# EAGLE design dynext_v2.1 (EAGLE 6.4)
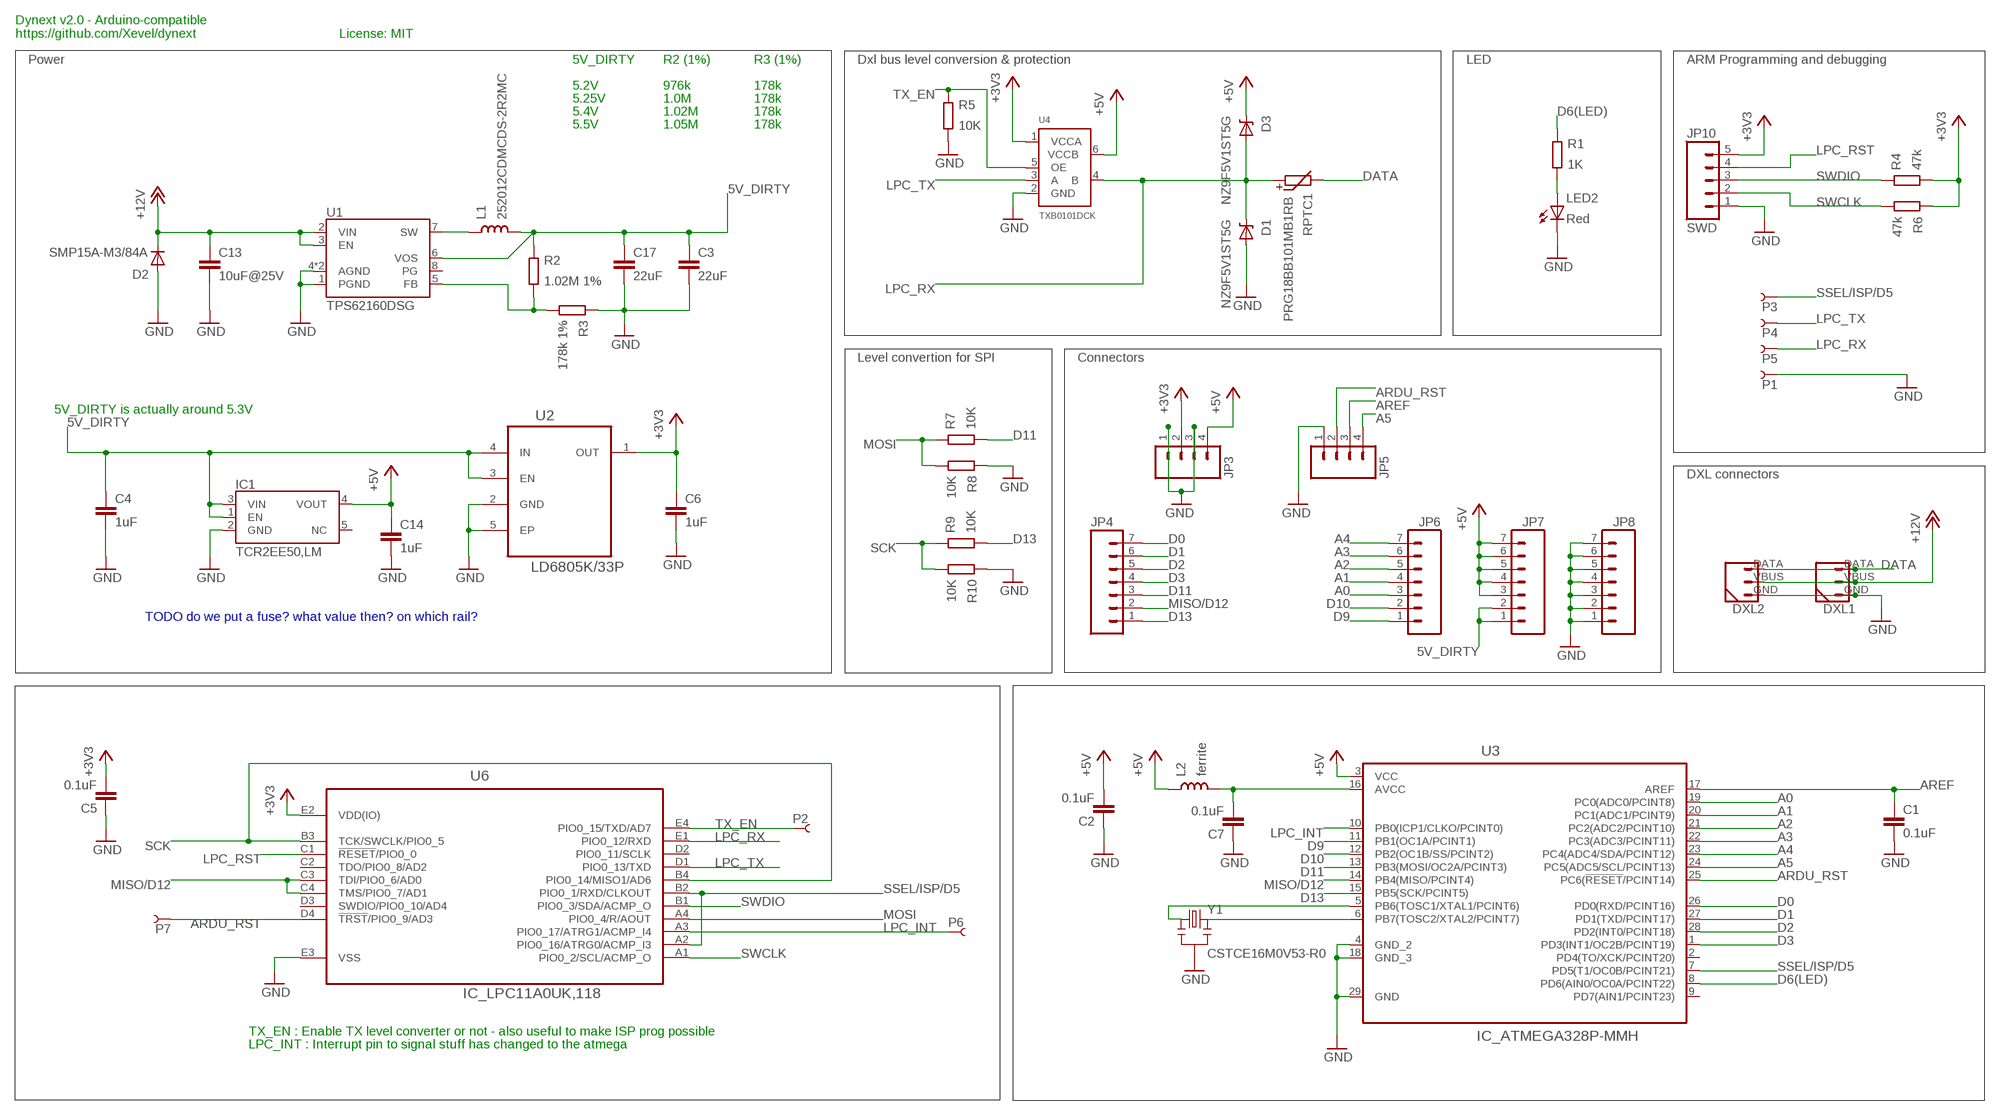
[diagram p0: schematic, sheet 1]

## Parts
C1  0.1uF  C0201  [0201_N]
C2  0.1uF  C0201  [0201_N]
C3  22uF  C1206  [1206_N]
C4  1uF  C0402  [0402_N]
C5  0.1uF  C0201  [0201_N]
C6  1uF  C0402  [0402_N]
C7  0.1uF  C0201  [0201_N]
C13  10uF@25V  C0805  [0805_N]
C14  1uF  C0402  [0402_N]
C17  22uF  C1206  [1206_N]
D1  NZ9F5V1ST5G  DIODE_ZENER-923  [SOD-923_N]
D2  SMP15A-M3/84A  DIODE-SMP  [DO-220AA]
D3  NZ9F5V1ST5G  DIODE_ZENER-923  [SOD-923_N]
DXL1  DYNAMIXEL_3POS-R  [DYNAMIXEL_3POS_RIGHT]
DXL2  DYNAMIXEL_3POS-R  [DYNAMIXEL_3POS_RIGHT]
IC1  TCR2EE50,LM  IC_TCR2EEESV  [SOT50P160X60-5N]
JP3  M041X04_NO_SILK  [1X04_NO_SILK]
JP4  M07NO_SILK  [1X07_NO_SILK]
JP5  M041X04_NO_SILK  [1X04_NO_SILK]
JP6  M07NO_SILK  [1X07_NO_SILK]
JP7  M07NO_SILK  [1X07_NO_SILK]
JP8  M07SQUARE_ALL  [1X07_SQUARE_ALL]
JP10  SWD  M051.27MM  [1X05-1.27MM]
L1  252012CDMCDS-2R2MC  L1008  [1008_N]
L2  ferrite  L0402  [0402_N]
LED2  Red  LED0603  [D_0603_N]
P1  PIN_SMD_0.8X2  [PIN_SMD_0.8X2]
P2  PIN_SMD_1X1  [PIN_SMD_1X1]
P3  PIN_SMD_0.8X2  [PIN_SMD_0.8X2]
P4  PIN_SMD_0.8X2  [PIN_SMD_0.8X2]
P5  PIN_SMD_0.8X2  [PIN_SMD_0.8X2]
P6  PIN_SMD_1X1  [PIN_SMD_1X1]
P7  PIN_SMD_1X1  [PIN_SMD_1X1]
R1  1K  R0201  [0201_N]
R2  1.02M 1%  R0201  [0201_N]
R3  178k 1%  R0201  [0201_N]
R4  47k  R0201  [0201_N]
R5  10K  R0201  [0201_N]
R6  47k  R0201  [0201_N]
R7  10K  R0201  [0201_N]
R8  10K  R0201  [0201_N]
R9  10K  R0201  [0201_N]
R10  10K  R0201  [0201_N]
RPTC1  PRG18BB101MB1RB  R-PTC0603  [0603_N]
U1  TPS62160DSG  IC_TPS62160DSG_L  [SON50P200X200X80-9L]
U2  LD6805K/33P  [NXP_LD6805]
U3  IC_ATMEGA328P-MMH  [QFN45P400X400X100-29N]
U4  TXB0101DCK  [SC70-6]
U6  IC_LPC11A0UK,118  [BGA20C50P_250X250X65]
Y1  CSTCE16M0V53-R0  RESONATOR16MHZ  [RESONATOR-SMD]

## Nets
5V_DIRTY: C3.1 C4.1 C17.1 IC1.1(EN) IC1.3(VIN) JP7.1 JP7.2 L1.2 R2.2 U1.6(VOS) U2.3(EN) U2.4(IN)
+3V3: C5.2 C6.1 JP3.2 JP10.5 R4.1 R6.2 U2.1(OUT) U4.1(VCCA) U6.E2(VDD(IO))
+5V: C2.2 C14.1 D3.C IC1.4(VOUT) JP3.4 JP7.3 JP7.4 JP7.5 JP7.6 JP7.7 L2.1 U3.3(VCC) U4.6(VCCB)
+12V: C13.1 D2.C DXL1.VBUS DXL2.VBUS U1.2(VIN) U1.3(EN)
A0: JP6.3 U3.19(PC0(ADC0/PCINT8))
A1: JP6.4 U3.20(PC1(ADC1/PCINT9))
A2: JP6.5 U3.21(PC2(ADC2/PCINT10))
A3: JP6.6 U3.22(PC3(ADC3/PCINT11))
A4: JP6.7 U3.23(PC4(ADC4/SDA/PCINT12))
A5: JP5.4 U3.24(PC5(ADC5/SCL/PCINT13))
ARDU_RST: JP5.2 P7.P$1 U3.25(PC6(!RESET!/PCINT14)) U6.D4(!TRST!/PIO0_9/AD3)
AREF: C1.1 JP5.3 U3.17(AREF)
AVCC: C7.2 L2.2 U3.16(AVCC)
D0: JP4.7 U3.26(PD0(RXD/PCINT16))
D1: JP4.6 U3.27(PD1(TXD/PCINT17))
D2: JP4.5 U3.28(PD2(INT0/PCINT18))
D3: JP4.4 U3.1(PD3(INT1/OC2B/PCINT19))
D6(LED): R1.2 U3.8(PD6(AIN0/OC0A/PCINT22))
D9: JP6.1 U3.11(PB1(OC1A/PCINT1))
D10: JP6.2 U3.12(PB2(OC1B/SS/PCINT2))
D11: JP4.3 R7.1 U3.13(PB3(MOSI/OC2A/PCINT3))
D13: JP4.1 R9.1 U3.15(PB5(SCK/PCINT5))
DATA: DXL1.DATA DXL2.DATA RPTC1.2
GND: C1.2 C2.1 C3.2 C4.2 C5.1 C6.2 C7.1 C13.2 C14.2 C17.2 D1.A D2.A DXL1.GND DXL2.GND IC1.2(GND) JP3.1 JP3.3 JP5.1 JP8.1 JP8.2 JP8.3 JP8.4 JP8.5 JP8.6 JP8.7 JP10.1 LED2.C P1.PIN R3.2 R5.1 R8.2 R10.2 U1.1(PGND) U1.4(AGND) U1.9(AGND) U2.2(GND) U2.5(EP) U3.4(GND_2) U3.18(GND_3) U3.29(GND) U4.2(GND) U6.E3(VSS) Y1.2
LPC_INT: P6.P$1 U3.10(PB0(ICP1/CLKO/PCINT0)) U6.A3(PIO0_17/ATRG1/ACMP_I4)
LPC_RST: JP10.4 U6.C1(!RESET!/PIO0_0)
LPC_RX: D1.C D3.A P5.PIN RPTC1.1 U4.4(B) U6.E1(PIO0_12/RXD)
LPC_TX: P4.PIN U4.3(A) U6.D1(PIO0_13/TXD)
MISO/D12: JP4.2 U3.14(PB4(MISO/PCINT4)) U6.C3(TDI/PIO0_6/AD0) U6.C4(TMS/PIO0_7/AD1)
MOSI: R7.2 R8.1 U6.A4(PIO0_4/R/AOUT)
N$2: L1.1 U1.7(SW)
N$3: LED2.A R1.1
N$9: U3.5(PB6(TOSC1/XTAL1/PCINT6)) Y1.1
N$10: U3.6(PB7(TOSC2/XTAL2/PCINT7)) Y1.3
N$12: R2.1 R3.1 U1.5(FB)
SCK: R9.2 R10.1 U6.B3(TCK/SWCLK/PIO0_5) U6.B4(PIO0_14/MISO1/AD6)
SSEL/ISP/D5: P3.PIN U3.7(PD5(T1/OC0B/PCINT21)) U6.A2(PIO0_16/ATRG0/ACMP_I3) U6.B2(PIO0_1/RXD/CLKOUT)
SWCLK: JP10.2 R6.1 U6.A1(PIO0_2/SCL/ACMP_O)
SWDIO: JP10.3 R4.2 U6.B1(PIO0_3/SDA/ACMP_O)
TX_EN: P2.P$1 R5.2 U4.5(OE) U6.E4(PIO0_15/TXD/AD7)
Unconnected: IC1.5(NC) U1.8(PG) U3.2(PD4(TO/XCK/PCINT20)) U3.9(PD7(AIN1/PCINT23)) U6.C2(TDO/PIO0_8/AD2) U6.D2(PIO0_11/SCLK) U6.D3(SWDIO/PIO0_10/AD4)

## Notes on the sheet
- Dynext v2.0 - Arduino-compatible
  https://github.com/Xevel/dynext
- License: MIT
- Power | 5V_DIRTY | R2 (1%) | R3 (1%) | Dxl bus level conversion & protection | LED | ARM Programming and debugging
- 5.2V | 976k | 178k
- 5.25V | 1.0M | 178k
- 5.4V | 1.02M | 178k
- 5.5V | 1.05M | 178k
- Level convertion for SPI | Connectors
- 5V_DIRTY is actually around 5.3V
- DXL connectors
- TODO do we put a fuse? what value then? on which rail?
- TX_EN : Enable TX level converter or not - also useful to make ISP prog possible
- LPC_INT : Interrupt pin to signal stuff has changed to the atmega

## Library data of the parts
C1-C7 C13 C14 C17 = Xevelabs:C: Non-polarized Capacitor
D1 D3 = Xevelabs:DIODE_ZENER: Zener Diode
D2 = Xevelabs:DIODE: Diode
DXL1 DXL2 = Xevelabs:DYNAMIXEL_3POS
IC1 = Xevelabs:IC_TCR2EE
JP3 JP5 = SparkFun-Connectors:M04: Header 4 Standard 4-pin 0.1" header. Use with straight break away headers (SKU : PRT-00116), right angle break away headers (PRT-00553), swiss pins (PRT-00743), machine pins (PRT-00117), and female headers (PRT-00115). Molex polarized connector foot print use with SKU : PRT-08231 with associated crimp pins and housings. 1MM SMD Version SKU: PRT-10208
JP4 JP6-JP8 = Xevelabs:M07: Header 7 Standard 7-pin 0.1" header. Use with straight break away headers (SKU : PRT-00116), right angle break away headers (PRT-00553), swiss pins (PRT-00743), machine pins (PRT-00117), and female headers (PRT-00115). NOTES ON THE VARIANTS LOCK and LOCK_LONGPADS... This footprint was designed to help hold the alignment of a through-hole component (i.e. 7-pin header) while soldering it into place. You may notice that each hole has been shifted either up or down by 0.005 of an inch from it's more standard position (which is usually a perfectly straight line). This slight alteration caused the pins (the squares in the middle) to touch the edges of the holes. Because they are alternating, it causes a "brace" to hold the header in place. 0.005 has proven to be the perfect amount of "off-center" position when using our standard breakaway headers. Although looks a little odd when you look at the bare footprint, once you have a header in there, the alteration is very hard to notice. Also, if you push a header all the way into place, it is covered up entirely on the bottom side. This idea of altering the position of holes to aid alignment will be further integrated into the Sparkfun Library for other footprints. It can help hold any component with 3 or more connection pins.
JP10 = SparkFun-Connectors:M05: Header 5 Standard 5-pin 0.1" header. Use with straight break away headers (SKU : PRT-00116), right angle break away headers (PRT-00553), swiss pins (PRT-00743), machine pins (PRT-00117), and female headers (PRT-00115). Molex polarized connector foot print use with SKU : PRT-08230 with associated crimp pins and housings.
L1 L2 = Xevelabs:L
LED2 = Xevelabs:LED: LED
P1-P7 = Xevelabs:PIN
R1-R10 = Xevelabs:R: Resistor
RPTC1 = Xevelabs:R-PTC: PTC (Positive Temperature Coefficient) Resistor
U1 = Xevelabs:IC_TPS62160
U2 = NXP-LD6805K:LD6805K/: Low-dropout regulators, high PSRR, 150 mA, DFN1010C-4; MPN: LD6805K/33P; OC_FARNELL: 2095530; OC_NEWARK: 93T1648; PACKAGE: DFN1010C-4; SUPPLIER: NXP
U3 = Xevelabs:IC_ATMEGA328P-MMH: MCU, 8BIT, AVR, MODL,QFN-28; MPN: ATMEGA328P-MMH; OC_FARNELL: 2066295; OC_NEWARK: 68T2937; PACKAGE: QFN-28; SUPPLIER: ATMEL
U4 = Xevelabs:TXB0101
U6 = Xevelabs:IC_LPC11A0?UK,118: IC, MCU, 32BIT, CORTEX M0, 20WLCSP LPC11A02UK,118 LPC11A04UK,118; MPN: LPC11A02UK,118; OC_FARNELL: 2218102; OC_NEWARK: 46W4731; PACKAGE: WLCSP20; SUPPLIER: NXP
Y1 = SparkFun-FreqCtrl:RESONATOR: Resonator Small SMD resonator. Used, eg, on the Arduino Pro/ Pro Mini boards. 8MHz- XTAL-08895 16MHz- XTAL-08900; PROD_ID: XTAL-08900; VALUE: 16MHz

## Board
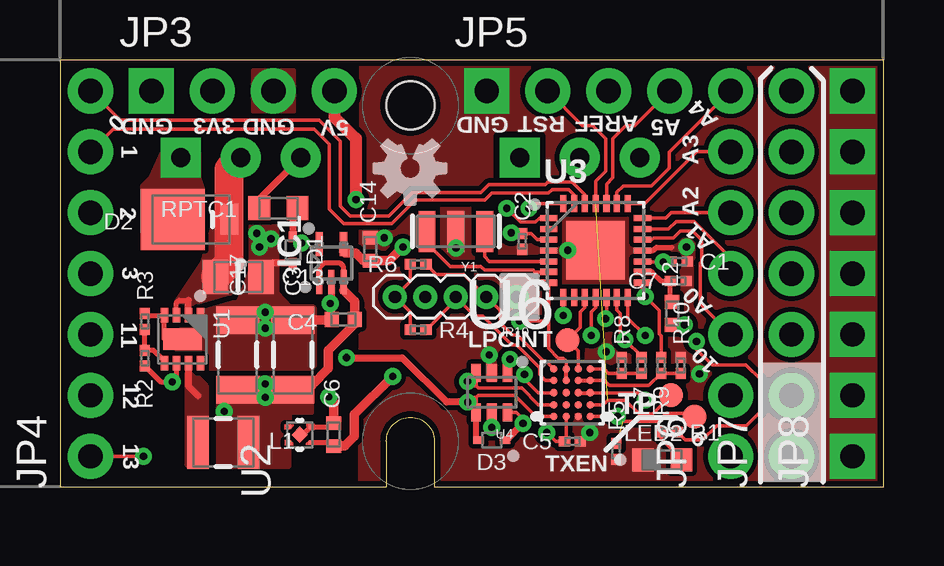
[diagram p1: board, top side]
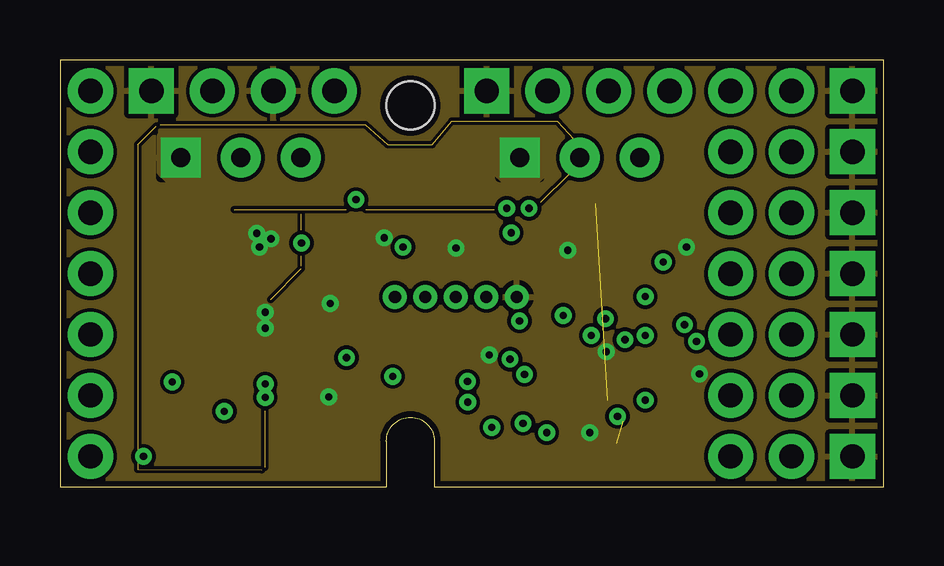
[diagram p2: board, inner layer GND]
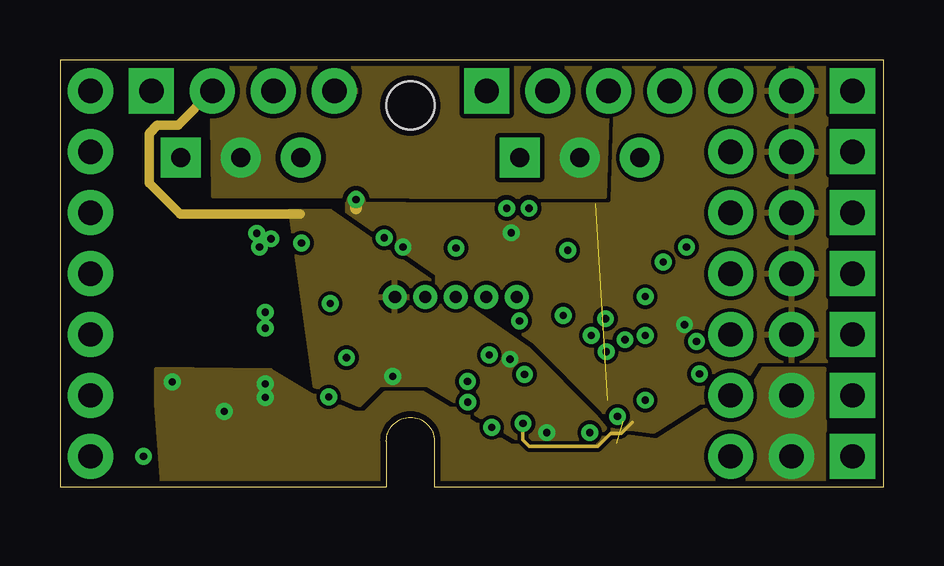
[diagram p3: board, inner layer POWER]
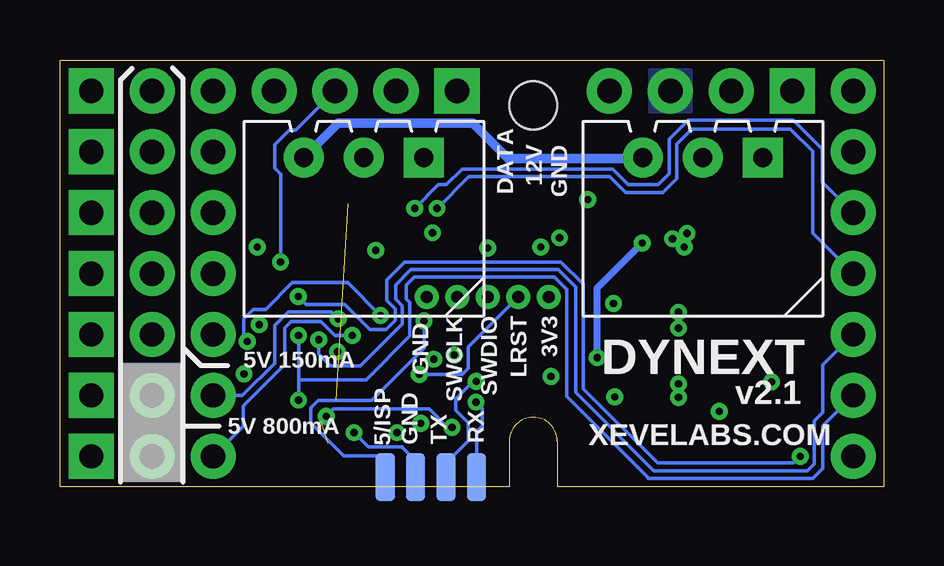
[diagram p4: board, bottom side, seen from below]

Size 34.32 x 17.8 mm. Coordinates in mm from the lower left corner, seen from the top.
Outline: 34.32,0 34.32,17.8 0,17.8 0,0 13.6,0 13.6,1.9 arc-180 15.6,1.9 15.6,0 34.32,0
Copper layers (1*2*3*16): Top 0.035mm / dielectric 0.15mm / GND 0.035mm / dielectric 1.1mm / POWER 0.035mm / dielectric 0.15mm / Bottom 0.035mm
Design rules "Xevelabs_6mil_4layers_eurocircuits *": minimum track width 0.15mm, minimum drill 0.25mm, track to track 0.155mm, track to pad 0.155mm, pad to pad 0.155mm, via to via 0.155mm, smd to smd 0mil, copper to edge 0.25mm, drill to drill 0.25mm, minimum pad ring 0.15mm, minimum via ring 0.2mm, stop-mask expansion 0mil, vias tented up to drill 100mil, thermal gap 0.2mm
Holes 2 mm at 14.6,15.9
tRestrict: area 18.3,12.9 to 20,14.6

### Footprints (pad centres in the part's own frame; a part is rotated, then mirrored left to right if it is on the bottom)
0201_N = smd 0.46 x 0.42: 1 -0.33,0; 2 0.33,0
1206_N = smd 1.15 x 1.8: 1 -1.45,0; 2 1.45,0
0402_N = smd 0.57 x 0.62: 1 -0.48,0; 2 0.48,0
0805_N = smd 1.05 x 1.4: 1 -0.95,0; 2 0.95,0
SOD-923_N = smd 0.43 x 0.32: A 0.55,0; C -0.55,0
DO-220AA = smd 2.67 x 2.54: A 0.7,0 | smd 0.76 x 1.27: C -1.65,0
DYNAMIXEL_3POS_RIGHT = drill 0.8 pad 1.676: DATA 0,-5; VBUS 0,-2.5 | drill 0.8 pad 1.676 square: GND 0,0
SOT50P160X60-5N = smd 0.991 x 0.254: 1 -0.787,0.508; 2 -0.787,0; 3 -0.787,-0.508 | smd 0.991 x 0.305: 4 0.787,-0.508; 5 0.787,0.508
1X04_NO_SILK = drill 1.016 pad 1.88 square: 1 0,0 | drill 1.016 pad 1.88: 2 2.54,0; 3 5.08,0; 4 7.62,0
1X07_NO_SILK = drill 1.016 pad 1.88: 1 0,0; 2 2.54,0; 3 5.08,0; 4 7.62,0; 5 10.16,0; 6 12.7,0; 7 15.24,0
1X07_SQUARE_ALL = drill 1.016 pad 1.88 square: 1 0,0; 2 2.54,0; 3 5.08,0; 4 7.62,0; 5 10.16,0; 6 12.7,0; 7 15.24,0
1X05-1.27MM = drill 0.508 pad 1: 1 0,0; 2 1.27,0; 3 2.54,0; 4 3.81,0; 5 5.08,0
1008_N = smd 0.9 x 2.2: 1 -1.05,0; 2 1.05,0
D_0603_N = smd 0.9 x 0.95: A 0.8,0; C -0.8,0
PIN_SMD_0.8X2 = smd 2 x 0.8: PIN 0,0
PIN_SMD_1X1 = smd 1 x 1: P$1 0,0
0603_N = smd 0.9 x 1: 1 -0.8,0; 2 0.8,0
SON50P200X200X80-9L = smd 0.6 x 0.3: 1 -1,0.75; 2 -1,0.25; 3 -1,-0.25; 4 -1,-0.75; 5 1,-0.75; 6 1,-0.25; 7 1,0.25; 8 1,0.75 | smd 0.9 x 1.6: 9 0,0
NXP_LD6805 = smd 0.17 x 0.17: 1 -0.325,-0.45; 2 0.325,-0.45; 3 0.325,0.45; 4 -0.325,0.45 | smd 0.48 x 0.48 rotated 45: 5 0,0
QFN45P400X400X100-29N = smd 0.711 x 0.254: 1 -1.956,1.346; 2 -1.956,0.889; 3 -1.956,0.457; 4 -1.956,0; 5 -1.956,-0.457; 6 -1.956,-0.889; 7 -1.956,-1.346; 15 1.956,-1.346; 16 1.956,-0.889; 17 1.956,-0.457; 18 1.956,0; 19 1.956,0.457; 20 1.956,0.889; 21 1.956,1.346 | smd 0.254 x 0.711: 8 -1.346,-1.956; 9 -0.889,-1.956; 10 -0.457,-1.956; 11 0,-1.956; 12 0.457,-1.956; 13 0.889,-1.956; 14 1.346,-1.956; 22 1.346,1.956; 23 0.889,1.956; 24 0.457,1.956; 25 0,1.956; 26 -0.457,1.956; 27 -0.889,1.956; 28 -1.346,1.956 | smd 2.438 x 2.438: 29 0,0
SC70-6 = smd 0.4 x 0.75: 1 -0.65,-0.825; 2 0,-0.825; 3 0.65,-0.825; 4 0.65,0.825; 5 0,0.825; 6 -0.65,0.825
BGA20C50P_250X250X65 = smd 0.305 x 0.305: A1 -0.762,0.991; A2 -0.254,0.991; A3 0.254,0.991; A4 0.762,0.991; B1 -0.762,0.508; B2 -0.254,0.508; B3 0.254,0.508; B4 0.762,0.508; C1 -0.762,0; C2 -0.254,0; C3 0.254,0; C4 0.762,0; D1 -0.762,-0.508; D2 -0.254,-0.508; D3 0.254,-0.508; D4 0.762,-0.508; E1 -0.762,-0.991; E2 -0.254,-0.991; E3 0.254,-0.991; E4 0.762,-0.991
RESONATOR-SMD = smd 0.7 x 1.7: 1 -1.2,0; 2 0,0; 3 1.2,0

### Placement (x,y rotation side)
C1  25.8,9.4 0 top
C2  19.25,10.23 90 top
C3  9.7,5.5 90 top
C4  11.8,6.97 180 top
C5  21.35,1.89 180 top
C6  11.41,2.18 90 top
C7  25.76,8.59 180 top
C13  7.42,8.75 0 top
C14  12.92,9.91 90 top
C17  7.4,5.5 90 top
D1  9.7,9.88 270 top
D2  5.4,11.15 180 top
D3  17.99,1.94 180 top
DXL1  5.04,13.73 270 bottom
DXL2  19.16,13.73 270 bottom
IC1  11.31,9.33 90 top
JP3  3.81,16.51 0 top
JP4  1.27,1.27 90 top
JP5  17.78,16.51 0 top
JP6  27.94,1.27 90 top
JP7  30.48,1.27 90 top
JP8  33.02,1.27 90 top
JP10  19.04,7.92 180 top
L1  6.8,1.85 0 top
L2  25.5,7.23 90 top
LED2  25.09,1.12 0 top
P1  19.5,0.41 270 bottom
P2  26.44,2.93 0 top
P3  20.77,0.41 270 bottom
P4  18.23,0.41 270 bottom
P5  16.96,0.41 270 bottom
P6  21.14,6.12 0 top
P7  25.46,3.83 0 top
R1  25.38,2.28 0 top
R2  3.53,5.37 270 top
R3  3.53,6.89 90 top
R4  14.92,6.55 0 top
R5  23.17,1.48 90 top
R6  14.92,9.28 180 top
R7  24.23,5.06 270 top
R8  23.41,5.06 90 top
R9  25.05,5.06 270 top
R10  25.87,5.06 90 top
RPTC1  9.1,11.62 180 top
U1  5.1,6.15 270 top
U2  9.99,2.17 90 top
U3  22.32,9.86 0 top
U4  17.99,3.93 180 top
U6  21.34,3.92 0 top
U$1  [OSHW-LOGO-S]  14.59,13.28 180 top
Y1  16.5,10.65 180 top

### Tracks (layer width: path | path; a pad name or v marks a point on that pad's centre or on a via)
5V_DIRTY  (via drill 0.3)
  Top 0.2: U1.6 4.85,4.55 v4.67,4.38 4.19,4.38 R2.2 | IC1.3 11.82,9.18 11.67,9.33 10.98,9.33 10.8,9.15 IC1.1
  Top 0.3: 11.82,8.18 IC1.3
  Top 0.4: C3.1 9.9,4.25 10.5,4.25 11.18,4.93 11.18,5.69 12.28,6.79 C4.1 12.28,7.72 11.82,8.18
  other vias: 8.55,3.73 8.55,4.29 6.85,3.15
  pour Top (no thermals): 6.6,0.85 8.46,0.85 8.75,2.57 8.69,2.66 9.52,3.12 10.49,3.12 10.5,4.53 6.6,4.53
  pour POWER (rank 3, no thermals): 4.35,-0.46 31.89,-0.39 31.87,4.89 29.31,4.92 28.53,3.67 27.11,3.35 24.86,1.91 18.23,2.78 15.62,3.93 13.57,3.9 11.91,3.77 10.56,3.76 8.79,4.83 4.01,4.9 4.02,3.43 4.29,-0.18
  pour Top (rank 5): 8.3,0.86 9.55,0.86 9.57,3.12 10.49,3.13 9.09,3.13 8.22,2.62 8.22,1.03 8.24,1.01
+3V3  (via drill 0.3)
  Top 0.15: U6.E2 21.09,1.96 arc-90 C5.2 20.65,1.89 v20.28,2.26 | R6.2 14.59,8.55 JP10.5 14.59,7.29 R4.1 | U4.1 18.64,5.21 v18.75,5.32
  Top 0.2: U2.1 11.27,1.84 C6.1
  Top 0.4: C6.1 11.86,1.7 12.27,2.11 12.27,3.01 v13.86,4.6
  POWER 0.4: JP3.2 4.92,15.08 4.06,15.08 3.71,14.73 3.71,12.66 5,11.37 10,11.37
  pour POWER (rank 2): 10.6,4.19 12.48,3.38 13.34,4.22 15.32,4.22 19.55,1.69 22.41,1.69 22.94,2.21 22.33,2.96 19.53,5.76 11.28,11.51 9.58,11.53
+5V  (via drill 0.3)
  Top 0.15: 19.93,10.31 U3.3 19.88,10.31 19.62,10.56 C2.2 19.23,10.59 v18.8,10.59 | U4.6 19.02,3.1 19.29,2.83 v19.29,2.64 | D3.C 18.59,1.94
  Top 0.2: L2.1 v26.02,6.76
  Top 0.3: 18.59,1.94 v19.29,2.64
  Top 0.4: v14.29,10 13.72,9.43 C14.1 12.63,9.43 12.32,9.74 11.89,9.74 11.82,9.82 IC1.4
  Top 0.5: JP3.4 11.43,15.42 12.33,14.52 v12.33,11.98
  POWER 0.15: v19.29,2.64 19.29,1.95 19.56,1.68 22.4,1.68 22.95,2.23 23.38,2.23 23.84,2.69
  POWER 0.5: v12.33,11.98 12.33,11.61
  pour POWER (rank 4): 31.95,18.71 31.93,-1.28 11.95,5.13 11.95,19.19 31.58,19.03
+12V
  Top 0.2: U1.3 4.85,7.67 4.95,7.78 5.35,7.78
  Top 0.3: U1.2 5.35,7.78
  Top 1.2: C13.1 7.05,9.32 D2.C 7.05,13.24 DXL1.VBUS
  pour POWER (isolate 0.2, no thermals): 22.7,12.11 22.89,18.21 6.3,18.34 6.38,12.14
  pour Top (no thermals): 6.55,11.41 7.55,9.28 7.1,8.07 5.45,7.6 5.28,7.7 4.85,7.7 5.97,9.4
A0
  Top 0.15: JP6.3 26.67,7.62 26.67,9.33 26.74,9.4 26.74,10.29 26.36,10.67 25.84,10.67 25.55,10.38 24.73,10.38 24.66,10.31 U3.19
A1
  Top 0.15: U3.20 25.34,10.74 25.67,11.07 26.42,11.07 27.94,9.55 JP6.4
A2
  Top 0.15: U3.21 25.24,11.2 25.47,11.43 JP6.5
A3
  Top 0.15: U3.22 24.37,11.81 26.53,13.97 JP6.6
A4
  Top 0.15: U3.23 23.2,12.28 23.47,12.55 24.64,12.55 25.38,13.29 25.38,13.95 JP6.7
A5
  Top 0.15: U3.24 22.77,12.63 23.04,12.9 23.04,14.52 23.58,15.06 23.95,15.06 JP5.4
ARDU_RST  (1 unrouted)
  Top 0.15: U3.25 22.32,12.76 22.73,13.17 22.73,14.52 22.19,15.06 21.77,15.06 JP5.2 | P7.P$1 25.46,3.8 24.69,3.03 24.13,3.03 23.56,3.6 22.82,3.6 22.64,3.42 U6.D4
AREF  (via drill 0.3)
  Top 0.15: 25.44,9.37 v25.13,9.37 24.3,9.37
  Top 0.2: 25.44,9.37 C1.1 | 24.3,9.37 U3.17
  Bottom 0.15: JP5.3 24.49,14.88 24.77,14.88 25.38,14.27 25.38,13.29 25.13,13.04 v25.13,9.37
AVCC
  Top 0.2: U3.16 24.66,8.97 25.05,8.59 C7.2 25.43,7.78 L2.2
D0
  Top 0.15: U3.26 21.86,12.19 21.34,12.71 20.32,12.71 20.21,12.6 17.86,12.6 17.53,12.27 14.68,12.27 13.69,11.28 12.09,11.28 11.67,11.7 11.67,14.41 10.8,15.28 2.5,15.28 JP4.7
D1
  Top 0.15: U3.27 21.43,12.16 21.19,12.4 20.51,12.4 20.35,12.24 17.98,12.24 17.7,11.96 14.81,11.96 13.82,10.97 11.83,10.97 11.21,11.59 11.21,14.3 10.59,14.92 2.22,14.92 JP4.6
D2  (via drill 0.3)
  Top 0.15: U3.28 19.74,11.81 v19.54,11.61
  Bottom 0.15: v19.54,11.61 18.55,12.6 18.22,12.6 17.57,13.25 11.29,13.25 10.64,12.6 9.4,12.6 8.94,13.06 8.94,14.49 8.14,15.29 3.76,15.29 2.55,14.08 2.55,12.71 JP4.5
D3  (via drill 0.3)
  Top 0.15: U3.1 19.98,11.2 19.81,11.03 19.19,11.03 v18.61,11.61
  Bottom 0.15: JP4.4 2.96,10.58 2.96,13.99 3.89,14.92 8,14.92 8.62,14.3 8.62,12.85 9.21,12.26 10.75,12.26 11.42,12.93 17.29,12.93 v18.61,11.61
D6(LED)  (via drill 0.3)
  Top 0.15: v26.52,6.06 26.52,5.73 27.17,5.08 28.58,5.08 29.21,4.45 29.21,3.17 28.59,2.55 27.36,2.55 26.77,1.96 26.05,1.96 25.73,2.28 R1.2 | v20.97,7.15 U3.8
  Bottom 0.15: v26.52,6.06 26.66,6.2 26.66,7.01 26.27,7.4 25.75,7.4 24.64,8.51 22.33,8.51 v20.97,7.15
D9  (via drill 0.3)
  Top 0.15: U3.11 22.32,7.47 22.14,7.3 v22.14,6.31
  Bottom 0.15: JP6.1 26.69,2.52 26.69,3.38 24.96,5.11 24.96,6.62 24.69,6.89 23.46,6.89 22.88,6.31 v22.14,6.31
D10  (via drill 0.3)
  Top 0.15: v22.73,7.01 22.77,7.05 U3.12
  Bottom 0.15: v22.73,7.01 23.02,7.3 24.81,7.3 25.38,6.73 25.38,5.15 26.72,3.81 JP6.2
D11  (via drill 0.3)
  Top 0.15: U3.13 23.2,7.37 23.34,7.23 23.34,6.33 v23.54,6.13 24.23,5.44 R7.1
  Bottom 0.15: v23.54,6.13 23.54,5.55 23.03,5.04 21.81,5.04 20.05,6.8 20.05,7.55 20.34,7.84 20.34,8.42 19.7,9.06 13.57,9.06 12.84,8.33 12.84,3.93 9.58,0.67 3.19,0.67 2.9,0.96 2.9,2.74 2.54,3.1 2.54,5.08 JP4.3
D13  (via drill 0.3)
  Top 0.15: R9.1 25.05,6.28 24.96,6.37 24.96,7.36 v24.39,7.93 24.27,8.05 U3.15 | v3.48,1.27 JP4.1
  Bottom 0.15: v24.39,7.93 24.07,7.61 22.45,7.61 21.41,6.57 20.72,6.57 20.36,6.93 20.36,7.42 20.7,7.76 20.7,8.63 19.95,9.38 13.45,9.38 12.52,8.45 12.52,4.09 9.42,0.99 3.76,0.99 v3.48,1.27
DATA
  Top 0.3: RPTC1.2 8.3,11.99 DXL1.DATA
  Bottom 0.4: DXL2.DATA 22.73,15.16 17.12,15.16 15.64,13.68 10.09,13.68 DXL1.DATA
GND  (via drill 0.3)
  Top 0.2: U3.18 24.73,9.86 24.85,9.98 25.5,9.98 | R3.2 3.6,7.15 U1.4 4.35,6.15 U1.9 | U2.5 10.12,2.17 U2.2 11.24,2.5 C6.2
  Top 0.3: D1.A 8.82,9.32 | IC1.2 C4.2
  Top 0.4: C3.2 11.3,6.95 C4.2 | C14.2 v13.51,10.38 | v11.2,3.75 11.41,3.54 C6.2
  Bottom 0.15: P1.PIN 19.5,1.08 20.06,1.64 arc-90 20.08,1.66 21.47,1.66 v22.07,2.26
  other vias: 8.55,7.28 8.55,6.61 8.31,9.99 8.2,10.57 8.79,10.35 21.16,9.86 26.1,10 16.5,9.96 22.76,5.63 26.65,4.71 17.89,5.5 11.26,7.64
  pour GND (rank 2): -1.43,-0.69 -1.43,19.07 34.82,19.26 34.77,11.36 34.92,-0.56
  pour Top (isolate 0.2, rank 2, no thermals): 6.58,8.88 5.5,7.47 5.53,6.45 5.05,6.45 4.85,6.25 4.85,5.85 5.78,5.83 5.8,5.05 10.5,5.05 10.5,7.42 9.53,7.42 8.95,8.05 8.95,10.85 7.58,10.85
  pour Top (isolate 0.2, no thermals): 12.58,18.68 35.09,18.52 34.9,-0.2 12.54,-0.2
  pour Top (rank 2, no thermals): 5.92,10.6 3.45,10.6 3.45,12.55 3.83,12.93 4.29,13.93 5.78,13.93 5.78,12.86 5.93,12.43
  pour GND (no thermals): 4.28,14.78 5.97,14.78 6.21,14.54 6.21,13.07 5.93,12.79 4.44,12.79 4.14,13.09 4.14,14.65 4.27,14.78
  pour GND (no thermals): 18.28,14.76 19.97,14.76 20.21,14.52 20.21,13.05 19.93,12.77 18.44,12.77 18.14,13.07 18.14,14.63 18.27,14.76
  pour Top: 2.95,17.37 4.67,17.37 4.67,15.65 2.95,15.65
  pour Bottom (no thermals): 8.03,17.37 9.75,17.37 9.75,15.65 8.03,15.65
  pour Top (no thermals): 8.03,17.37 9.75,17.37 9.75,15.65 8.03,15.65
LPC_INT
  Top 0.15: U3.10 21.86,7.48 21.67,7.29 21.67,6.65 P6.P$1 21.59,5.67 U6.A3
LPC_RST  (via drill 0.3)
  Top 0.15: U6.C1 19.93,3.92 19.35,4.5 v19.35,4.69
  Bottom 0.15: v19.35,4.69 17.56,4.69 17.31,4.94 17.31,5.83 JP10.4
LPC_RX  (via drill 0.3)
  Top 0.15: U4.4 17.34,3.72 | 17.34,3.72 17.43,3.81 18.95,3.81 19.83,2.93 U6.E1 | v16.99,3.53 17.18,3.72 17.34,3.72 | D3.A 17.34,2.04
  Top 0.25: 17.34,2.04 U4.4
  Top 0.3: v16.99,3.53 16.11,3.53 14.26,5.38 v11.94,5.38 | v10.06,10.16 9.96,10.16 D1.C 9.7,11.42 RPTC1.1
  Bottom 0.15: 16.74,3.28 v16.99,3.53 16.73,3.27 16.73,2.54 16.96,2.31 P5.PIN
  Bottom 0.3: v10.06,10.16 11.94,8.28 v11.94,5.38
LPC_TX  (via drill 0.3)
  Top 0.15: U6.D1 19.93,3.42 19.23,4.12 17.43,4.12 17.34,4.21 | 17.34,4.21 U4.3 | v16.98,4.39 17.16,4.21 17.34,4.21
  Bottom 0.15: v16.98,4.39 17.11,4.39 17.84,3.66 17.84,3.19 17.31,2.66 17.31,1.92 18.09,1.14 18.23,1.14 P4.PIN
MISO/D12  (via drill 0.3)
  Top 0.15: v24.38,6.31 23.66,7.03 U3.14 | v24.38,3.61 24.08,3.91 22.12,3.91 arc-90 U6.C4
  Top 0.16: U6.C3 U6.C4
  Bottom 0.15: v24.38,6.31 24.38,4.46 | 24.38,4.46 v24.38,3.61 | 24.38,4.46 21.57,4.46 19.74,6.29 19.74,7.68 19.9,7.84 19.9,8.41 19.57,8.74 13.73,8.74 13.21,8.22 13.21,3.76 9.82,0.37 9.82,0.36 2.95,0.36 2.54,0.77 2.54,2.54 JP4.2
MOSI
  Top 0.15: R7.2 R8.1 22.85,4.73 22.67,4.91 U6.A4
N$2
  Top 0.3: U1.7 5.35,4.2 5.75,3.8
  pour Top (no thermals): 6.05,0.9 5.35,0.9 5.35,4.75 5.6,4.5 5.75,4.5 6.05,4.2
N$3
  Top 0.15: LED2.A 25.89,1.15 25.05,1.99 R1.1
N$4
  GND 0: 4.18,15.1 12.71,15.1 13.66,14.27 15.5,14.27 16.32,15.24 20.72,15.24 21.41,14.5
N$5
  GND 0: 21.21,13.05 20.02,11.86
N$6
  GND 0: 10.06,9.21 10.06,9.63
N$7
  GND 0: 7.25,11.56 11.93,11.56
N$8
  GND 0: 12.73,11.56 18.1,11.56
N$9
  Top 0.15: U3.5 17.89,9.4 17.7,9.6 Y1.1
N$10
  Top 0.15: U3.6 19.78,8.97 19.71,9.04 17.69,9.04 17.54,9.19 16.25,9.19 15.41,10.03 15.41,10.54 Y1.3
N$11
  GND 0: 8.54,3.16 8.54,0.81
N$12
  Top 0.2: U1.5 4.35,5.24 3.9,5.7 R2.1 R3.1
N$14
  GND 0: 8.78,7.82 10.06,9.1
N$15
  GND 0: 10.06,10.71 10.06,11.38
N$16
  GND 0: 8.4,0.71 3.24,0.72 3.24,14.27 4,15.03
SCK
  Top 0.15: R10.1 R9.2 24.54,4.22 22.89,4.22 22.68,4.43 U6.B4
  Top 0.16: U6.B3 U6.B4
SSEL/ISP/D5  (via drill 0.3)
  Top 0.15: 20.36,6.91 20.36,5.76 20.76,5.36 20.97,5.36 21.09,5.24 U6.A2 | 20.36,6.91 U3.7 | v19.15,6.91 20.36,6.91
  Top 0.16: U6.B2 U6.A2
  Bottom 0.15: P3.PIN 20.77,0.95 21.11,1.29 22.5,1.29 23.87,2.66 23.87,3.29 23.56,3.6 21.34,3.6 19.15,5.79 v19.15,6.91
SWCLK
  Top 0.15: U6.A1 20.24,5.25 20.13,5.25 19.05,6.33 18.85,6.33 18.34,6.84 18.34,7.35 JP10.2 16.82,8.86 15.67,8.86 R6.1
SWDIO
  Top 0.15: U6.B1 20.23,4.43 19.98,4.68 19.98,4.96 19.03,5.91 18.83,5.91 17.61,7.13 17.29,7.13 JP10.3 16.5,7.79 R4.2
TX_EN  (via drill 0.3)  (1 unrouted)
  Top 0.15: P2.P$1 26.3,3.07 25.26,3.07 24.91,2.72 23.45,2.72 v23.23,2.94 U6.E4 | U4.5 v17.99,2.48
  Bottom 0.15: v17.99,2.48 18.18,2.48 18.94,3.24 22.93,3.24 v23.23,2.94

### Text on the board
tPlace: 0 | GND | 3V3 | GND | 5V | GND | RST | AREF | A5 | A3 | A4 | 1 | A2 | 2 | A1 | 3 | A0 | 11 | LPCINT | 10 | 12 | TP | 13 | 9 | TXEN
bPlace: GND | 12V | DATA | 3V3 | LRST | SWDIO | SWCLK | GND | DYNEXT | 5V 150mA | v2.1 | XEVELABS.COM | RX | TX | GND | 5/ISP | 5V 800mA